# EAGLE design untitled (EAGLE 9.6.2)
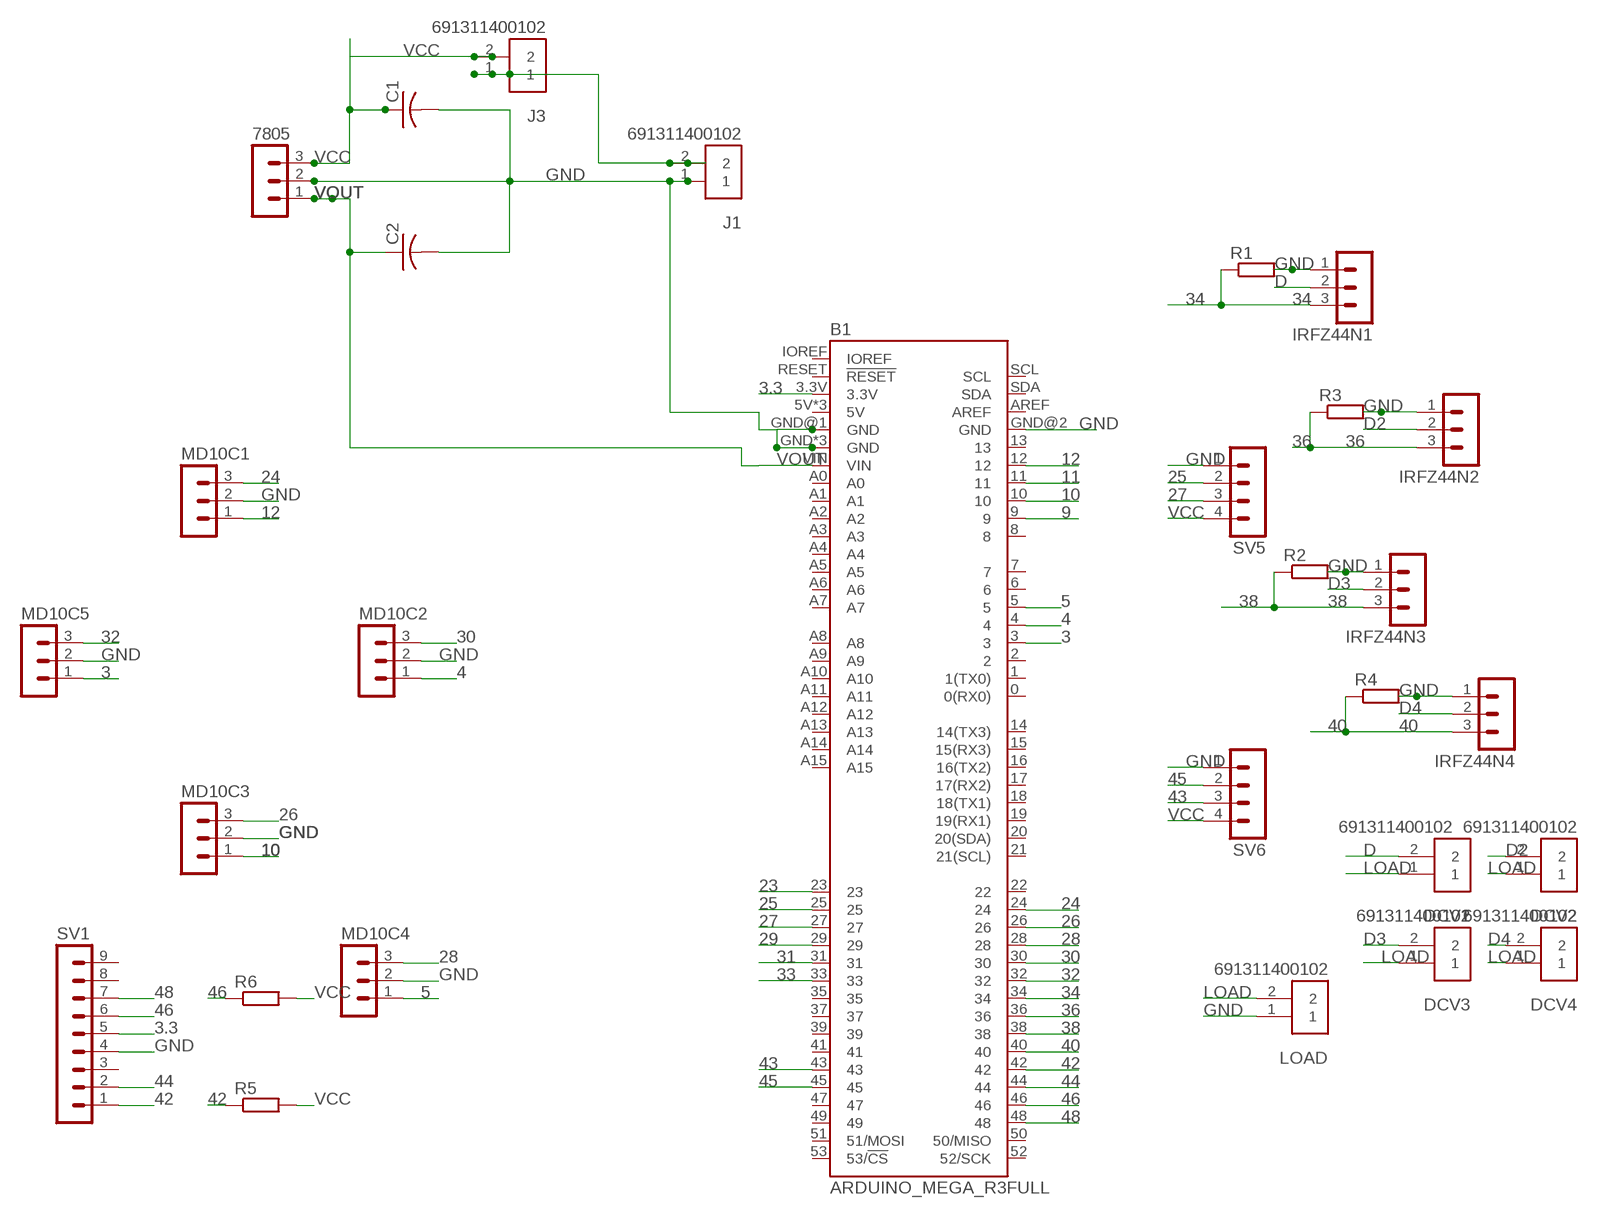
[diagram p0: schematic, sheet 1]

## Parts
7805  MA03-1  [MA03-1]
B1  ARDUINO_MEGA_R3FULL  [ARDUINO_MEGA_NO_SILK]
C1  C-US025-024X044  [C025-024X044]
C2  C-US025-024X044  [C025-024X044]
DCV1  691311400102  [TERMINALBLOCK_PLUGGABLE-2-7.62MM]
DCV2  691311400102  [TERMINALBLOCK_PLUGGABLE-2-7.62MM]
DCV3  691311400102  [TERMINALBLOCK_PLUGGABLE-2-7.62MM]
DCV4  691311400102  [TERMINALBLOCK_PLUGGABLE-2-7.62MM]
IRFZ44N1  MA03-1  [MA03-1]
IRFZ44N2  MA03-1  [MA03-1]
IRFZ44N3  MA03-1  [MA03-1]
IRFZ44N4  MA03-1  [MA03-1]
J1  691311400102  [TERMINALBLOCK_PLUGGABLE-2-7.62MM]
J3  691311400102  [TERMINALBLOCK_PLUGGABLE-2-7.62MM]
LOAD  691311400102  [TERMINALBLOCK_PLUGGABLE-2-7.62MM]
MD10C1  MA03-1  [MA03-1]
MD10C2  MA03-1  [MA03-1]
MD10C3  MA03-1  [MA03-1]
MD10C4  MA03-1  [MA03-1]
MD10C5  MA03-1  [MA03-1]
R1  R-EU_0204_5  [0204/5]
R2  R-EU_0204_5  [0204/5]
R3  R-EU_0204_5  [0204/5]
R4  R-EU_0204_5  [0204/5]
R5  R-EU_0204_5  [0204/5]
R6  R-EU_0204_5  [0204/5]
SV1  MA09-1  [MA09-1]
SV5  MA04-1  [MA04-1]
SV6  MA04-1  [MA04-1]

## Nets
3: B1.3 MD10C5.1
3.3: B1.3.3V SV1.5
4: B1.4 MD10C2.1
5: B1.5 MD10C4.1
9: B1.9
10: B1.10 MD10C3.1
11: B1.11
12: B1.12 MD10C1.1
23: B1.23
24: B1.24 MD10C1.3
25: B1.25 SV5.2
26: B1.26 MD10C3.3
27: B1.27 SV5.3
28: B1.28 MD10C4.3
29: B1.29
30: B1.30 MD10C2.3
31: B1.31
32: B1.32 MD10C5.3
33: B1.33
34: B1.34 IRFZ44N1.3 R1.1
36: B1.36 IRFZ44N2.3 R3.1
38: B1.38 IRFZ44N3.3 R2.1
40: B1.40 IRFZ44N4.3 R4.1
42: B1.42 R5.1 SV1.1
43: B1.43 SV6.3
44: B1.44 SV1.2
45: B1.45 SV6.2
46: B1.46 R6.1 SV1.6
48: B1.48 SV1.7
D: DCV1.2 IRFZ44N1.2
D2: DCV2.2 IRFZ44N2.2
D3: DCV3.2 IRFZ44N3.2
D4: DCV4.2 IRFZ44N4.2
GND: 7805.2 B1.GND B1.GND@1(GND) B1.GND@2(GND) B1.GND@3(GND) B1.GND@4(GND) C1.2 C2.2 IRFZ44N1.1 IRFZ44N2.1 IRFZ44N3.1 IRFZ44N4.1 J1.1 LOAD.1 MD10C1.2 MD10C2.2 MD10C3.2 MD10C4.2 MD10C5.2 R1.2 R2.2 R3.2 R4.2 SV1.4 SV5.1 SV6.1
LOAD: DCV1.1 DCV2.1 DCV3.1 DCV4.1 LOAD.2
VCC: 7805.3 C1.1 J3.2 R5.2 R6.2 SV5.4 SV6.4
VIN: J1.2 J3.1
VOUT: 7805.1 B1.VIN C2.1
Unconnected: B1.0(0(RX0)) B1.1(1(TX0)) B1.2 B1.5V B1.5V@1(5V) B1.5V@2(5V) B1.6 B1.7 B1.8 B1.13 B1.14(14(TX3)) B1.15(15(RX3)) B1.16(16(TX2)) B1.17(17(RX2)) B1.18(18(TX1)) B1.19(19(RX1)) B1.20(20(SDA)) B1.21(21(SCL)) B1.22 B1.35 B1.37 B1.39 B1.41 B1.47 B1.49 B1.50(50/MISO) B1.51(51/MOSI) B1.52(52/SCK) B1.53(53/!CS) B1.A0 B1.A1 B1.A2 B1.A3 B1.A4 B1.A5 B1.A6 B1.A7 B1.A8 B1.A9 B1.A10 B1.A11 B1.A12 B1.A13 B1.A14 B1.A15 B1.AREF B1.IOREF B1.RESET(!RESET) B1.SCL B1.SDA SV1.3 SV1.8 SV1.9

## Library data of the parts
7805 IRFZ44N1-IRFZ44N4 MD10C1-MD10C5 = con-lstb:MA03-1: PIN HEADER; OC_FARNELL: unknown; OC_NEWARK: unknown
B1 = SparkFun-Boards:ARDUINO_MEGA_R3: Arduino Mega R3 ATmega2560 R3 compatible footprint. SparkFun Products: Arduino Mega 2560 R3 <https://www.sparkfun.com/products/11061>
C1 C2 = resistor:C-US: CAPACITOR, American symbol
DCV1-DCV4 J1 J3 LOAD = Terminal Blocks FOR USE IN PB:691311400102: 7.62MM CLOSE VERTICAL PCB HEADER WR-TBL Manufacturer's datasheet <https://katalog.we-online.com/em/datasheet/6913114001xx.pdf>; CREATED_BY: PCBLayout.com; DIGIKEY_PART_NO: 732-2823-ND; MANUFACTURER: WURTH ELEKTRONIK; MPN: 691311400102
R1-R6 = resistor:R-EU_: RESISTOR, European symbol; SPICEPREFIX: R
SV1 = con-lstb:MA09-1: PIN HEADER; OC_FARNELL: unknown; OC_NEWARK: unknown
SV5 SV6 = con-lstb:MA04-1: PIN HEADER; OC_FARNELL: unknown; OC_NEWARK: unknown

## Board
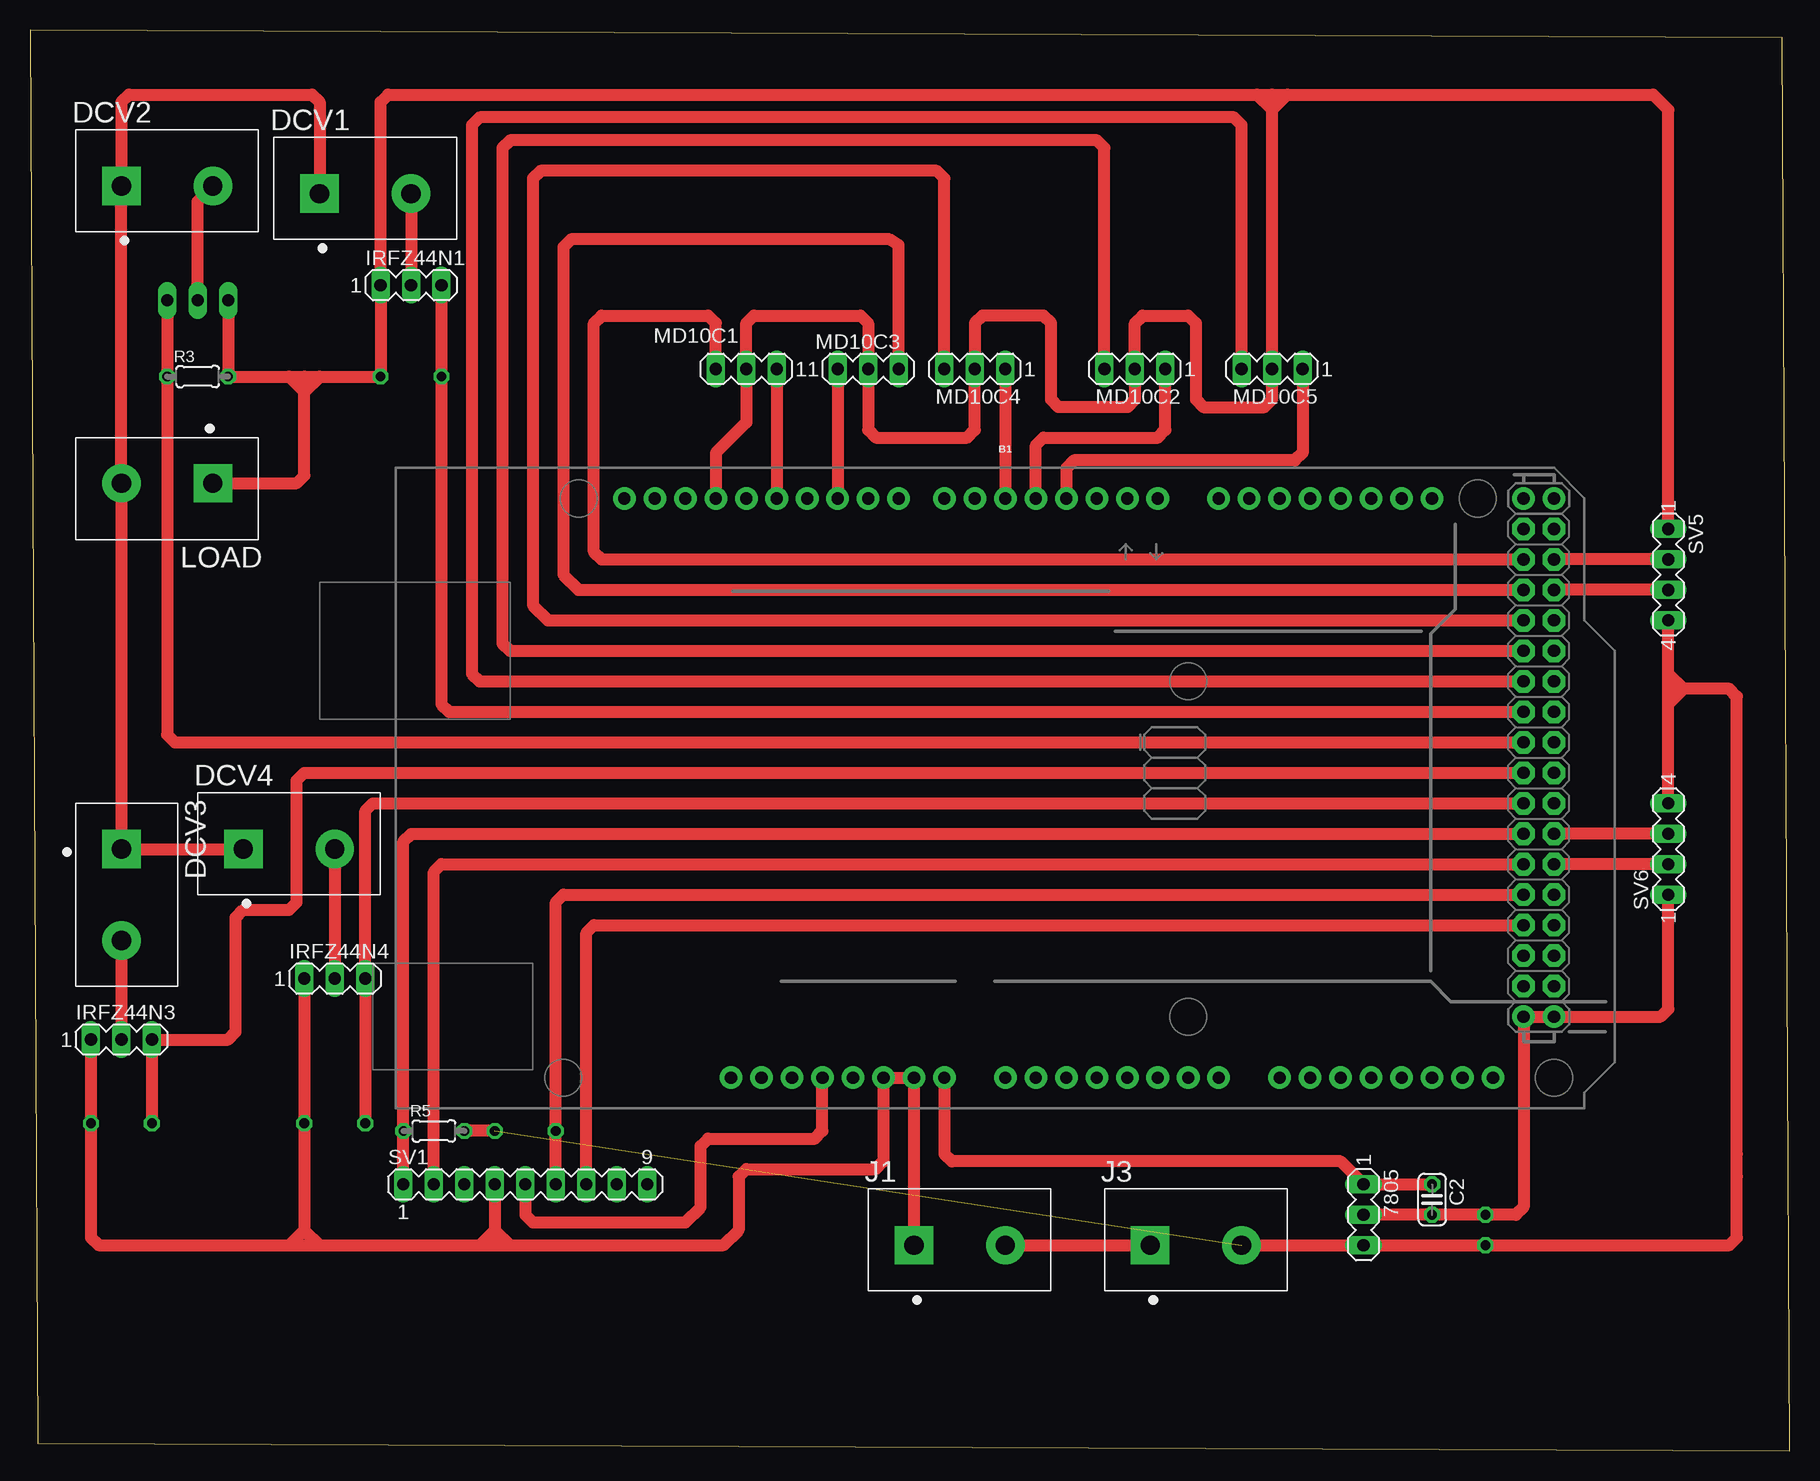
[diagram p1: board, top side]
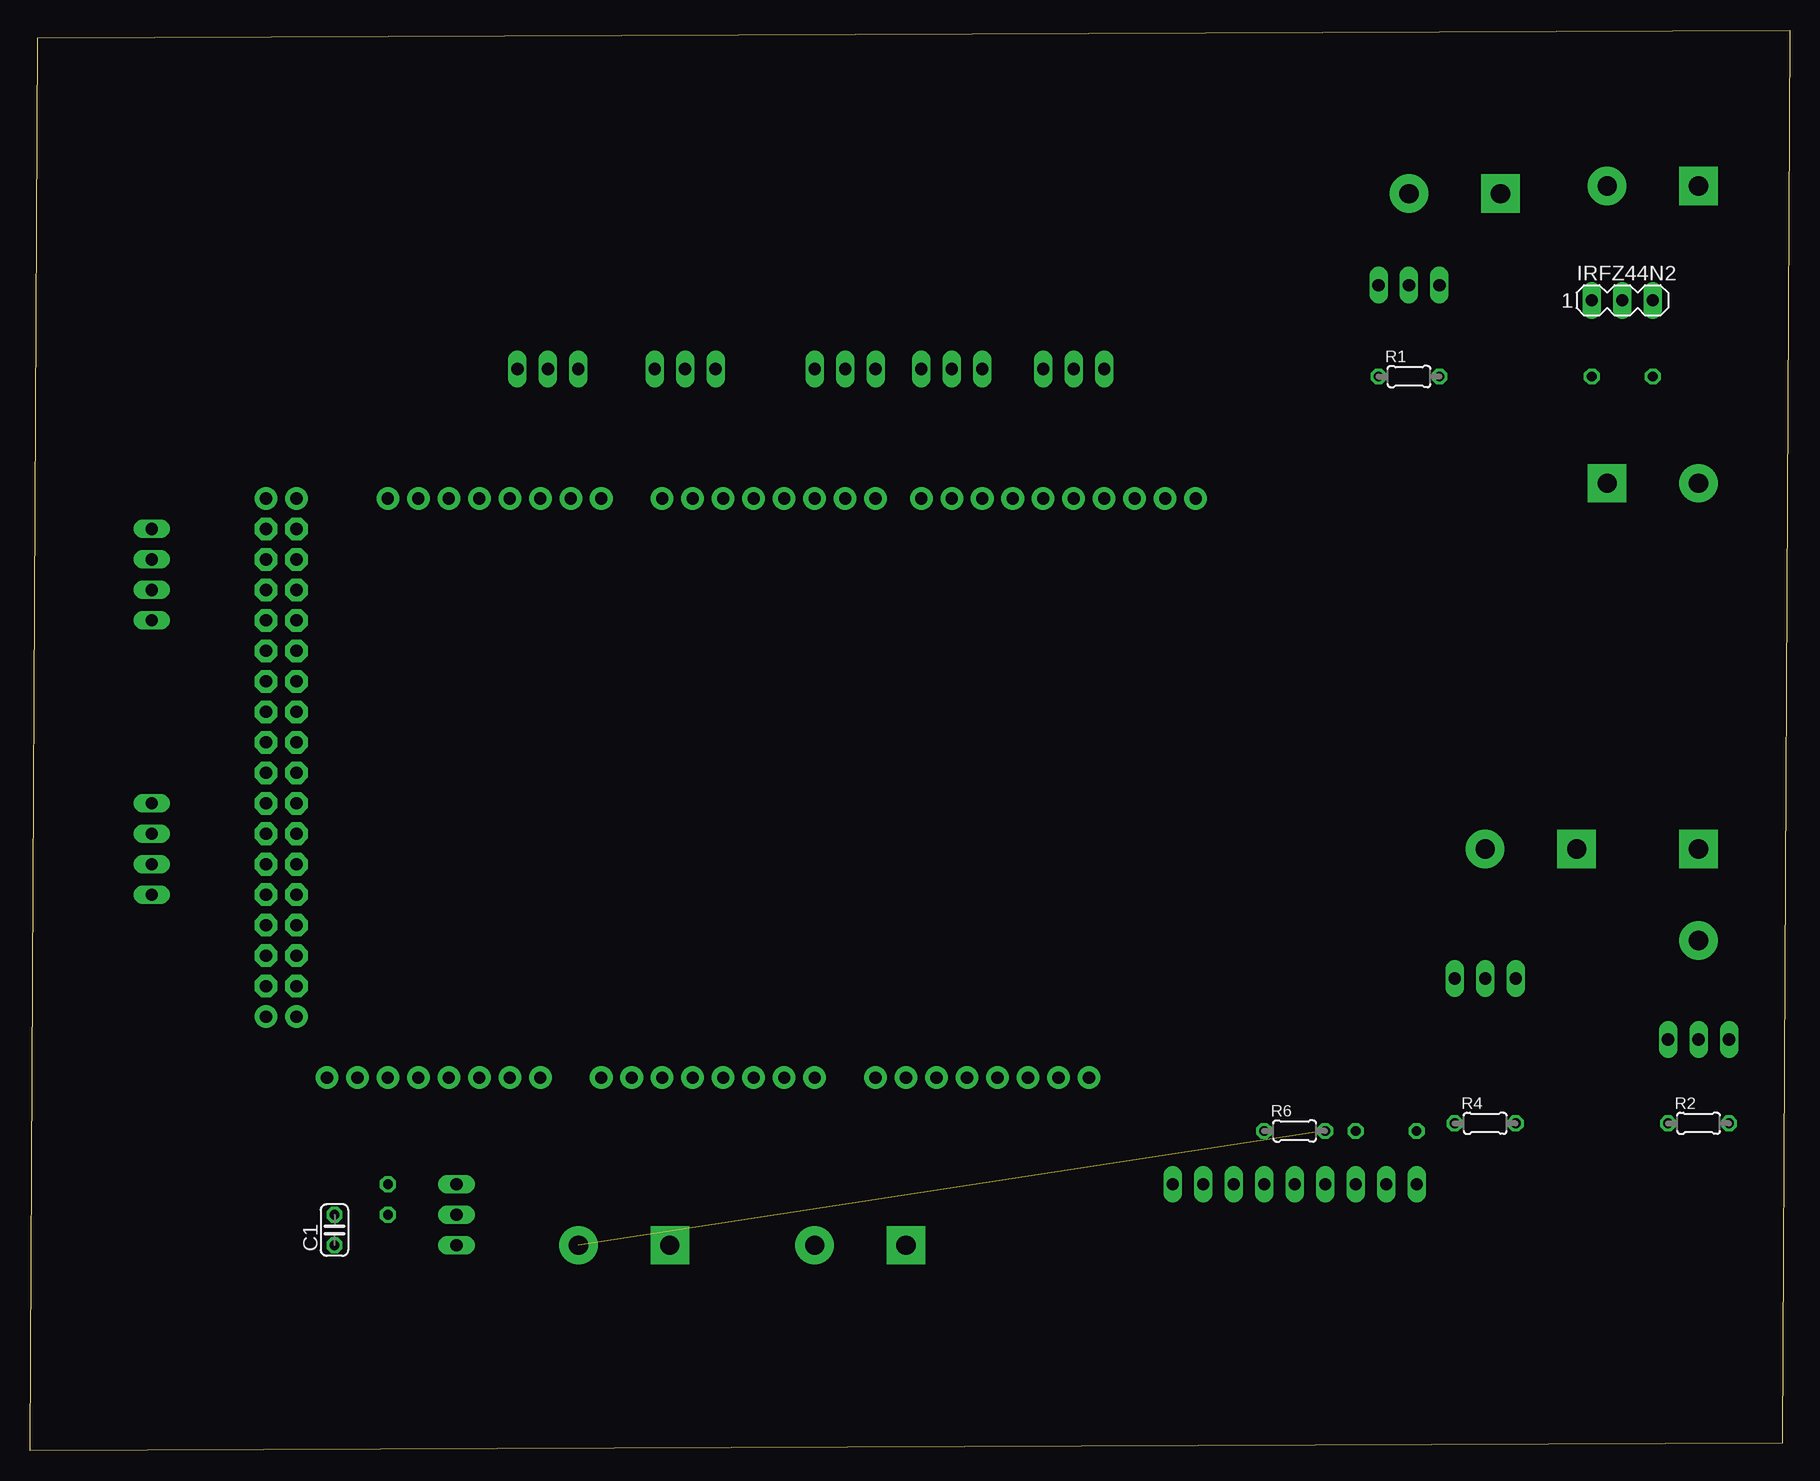
[diagram p2: board, bottom side, seen from below]

Size 146.66 x 118.41 mm. Coordinates in mm from the lower left corner, seen from the top.
Outline: 0.64,0.64 146.66,0 146.03,117.78 0,118.41 0.64,0.64
Copper layers (1*16): Top 0.035mm / dielectric 1.5mm / Bottom 0.035mm
Design rules "default": minimum track width 6mil, minimum drill 0.35mm, track to track 6mil, track to pad 6mil, pad to pad 6mil, via to via 6mil, smd to smd 6mil, copper to edge 40mil, drill to drill 6mil, minimum pad ring 10mil, minimum via ring 8mil, stop-mask expansion 4mil, vias tented up to drill 0mil, thermal gap 10mil

### Footprints (pad centres in the part's own frame; a part is rotated, then mirrored left to right if it is on the bottom)
MA03-1 = drill 1.016 long: 1 -2.54,0; 2 0,0; 3 2.54,0
ARDUINO_MEGA_NO_SILK = drill 1.016 pad 1.88: 0 13.97,24.13; 1 11.43,24.13; 2 8.89,24.13; 3 6.35,24.13; 3.3V -13.97,-24.13; 4 3.81,24.13; 5 1.27,24.13; 5V -11.43,-24.13; 5V@1 44.45,24.13; 5V@2 46.99,24.13; 6 -1.27,24.13; 7 -3.81,24.13; 8 -7.62,24.13; 9 -10.16,24.13; 10 -12.7,24.13; 11 -15.24,24.13; 12 -17.78,24.13; 13 -20.32,24.13; 14 19.05,24.13; 15 21.59,24.13; 16 24.13,24.13; 17 26.67,24.13; 18 29.21,24.13; 19 31.75,24.13; 20 34.29,24.13; 21 36.83,24.13; A0 1.27,-24.13; A1 3.81,-24.13; A2 6.35,-24.13; A3 8.89,-24.13; A4 11.43,-24.13; A5 13.97,-24.13; A6 16.51,-24.13; A7 19.05,-24.13; A8 24.13,-24.13; A9 26.67,-24.13; A10 29.21,-24.13; A11 31.75,-24.13; A12 34.29,-24.13; A13 36.83,-24.13; A14 39.37,-24.13; A15 41.91,-24.13; AREF -25.4,24.13; GND -8.89,-24.13; GND@1 -6.35,-24.13; GND@2 44.45,-19.05; GND@3 46.99,-19.05; GND@4 -22.86,24.13; IOREF -19.05,-24.13; NC -21.59,-24.13; RESET -16.51,-24.13; SCL -30.48,24.13; SDA -27.94,24.13; VIN -3.81,-24.13 | drill 1.016 pad 1.88 octagon: 22 44.45,21.59; 23 46.99,21.59; 24 44.45,19.05; 25 46.99,19.05; 26 44.45,16.51; 27 46.99,16.51; 28 44.45,13.97; 29 46.99,13.97; 30 44.45,11.43; 31 46.99,11.43; 32 44.45,8.89; 33 46.99,8.89; 34 44.45,6.35; 35 46.99,6.35; 36 44.45,3.81; 37 46.99,3.81; 38 44.45,1.27; 39 46.99,1.27; 40 44.45,-1.27; 41 46.99,-1.27; 42 44.45,-3.81; 43 46.99,-3.81; 44 44.45,-6.35; 45 46.99,-6.35; 46 44.45,-8.89; 47 46.99,-8.89; 48 44.45,-11.43; 49 46.99,-11.43; 50 44.45,-13.97; 51 46.99,-13.97; 52 44.45,-16.51; 53 46.99,-16.51
C025-024X044 = drill 0.813 octagon: 1 -1.27,0; 2 1.27,0
TERMINALBLOCK_PLUGGABLE-2-7.62MM = drill 1.6 pad 3.2 square: 1 -3.81,0 | drill 1.6 pad 3.2: 2 3.81,0
0204/5 = drill 0.813 octagon: 1 -2.54,0; 2 2.54,0
MA09-1 = drill 1.016 long: 1 -10.16,0; 2 -7.62,0; 3 -5.08,0; 4 -2.54,0; 5 0,0; 6 2.54,0; 7 5.08,0; 8 7.62,0; 9 10.16,0
MA04-1 = drill 1.016 long: 1 -3.81,0; 2 -1.27,0; 3 1.27,0; 4 3.81,0

### Placement (x,y rotation side)
7805  111.12,19.69 270 top
B1  80.01,55.25 0 top
C1  121.29,18.42 90 bottom
C2  116.84,20.96 270 top
DCV1  27.94,104.78 0 top
DCV2  11.43,105.41 0 top
DCV3  7.62,46.36 270 top
DCV4  21.59,50.17 0 top
IRFZ44N1  31.75,97.16 0 top
IRFZ44N2  13.97,95.88 0 bottom
IRFZ44N3  7.62,34.29 0 top
IRFZ44N4  25.4,39.37 0 top
J1  77.47,17.15 0 top
J3  97.16,17.15 0 top
LOAD  11.43,80.65 180 top
MD10C1  59.69,90.17 180 top
MD10C2  92.08,90.17 180 top
MD10C3  69.85,90.17 0 top
MD10C4  78.74,90.17 180 top
MD10C5  103.51,90.17 180 top
R1  31.75,89.53 0 bottom
R2  7.62,27.3 0 bottom
R3  13.97,89.53 0 top
R4  25.4,27.3 0 bottom
R5  33.65,26.67 0 top
R6  41.27,26.67 0 bottom
SV1  41.27,22.23 0 top
SV5  136.52,73.03 270 top
SV6  136.52,50.17 90 top

### Tracks (layer width: path | path; a pad name or v marks a point on that pad's centre or on a via)
3
  Top 1.016: MD10C5.1 106.05,83.19 105.41,82.55 87,82.55 86.36,81.91 B1.3
3.3
  Top 1.016: SV1.5 41.27,19.69 41.91,19.05 54.61,19.05 55.88,20.32 55.88,25.4 56.51,26.04 65.41,26.04 66.04,26.67 B1.3.3V
4
  Top 1.016: B1.4 83.82,83.82 84.45,84.45 93.98,84.45 94.62,85.09 MD10C2.1
5
  Top 1.016: MD10C4.1 B1.5
10
  Top 1.016: MD10C3.1 B1.10
12
  Top 1.016: MD10C1.1 B1.12
24
  Top 1.016: MD10C1.3 57.15,93.98 56.51,94.62 47.62,94.62 46.99,93.98 46.99,74.93 47.62,74.3 B1.24
25
  Top 1.016: SV5.2 B1.25
26
  Top 1.016: B1.26 45.72,71.75 44.45,73.03 44.45,100.33 45.08,100.97 71.63,100.97 72.39,100.49 MD10C3.3
27
  Top 1.016: SV5.3 B1.27
28
  Top 1.016: MD10C4.3 76.2,106.04 75.56,106.68 42.54,106.68 41.91,106.04 41.91,70.48 43.18,69.22 B1.28
30
  Top 1.016: MD10C2.3 89.54,108.59 88.9,109.22 40,109.22 39.37,108.59 39.37,67.31 40,66.68 B1.30
32
  Top 1.016: MD10C5.3 100.97,110.49 100.33,111.12 37.46,111.12 36.83,110.49 36.83,64.77 37.46,64.13 B1.32
34
  Top 1.016: IRFZ44N1.3 R1.1 34.29,62.23 34.92,61.59 B1.34
36
  Top 0.152: 124.46,58.95 B1.36
  Top 1.016: IRFZ44N2.3 R3.1 11.43,59.69 12.07,59.05 B1.36
38
  Top 1.016: R2.1 IRFZ44N3.3 16.51,34.29 17.14,34.92 17.14,44.45 17.78,45.09 21.59,45.09 22.23,45.72 22.23,55.88 22.86,56.52 B1.38
40
  Top 1.016: R4.1 IRFZ44N4.3 27.94,53.34 28.57,53.98 B1.40
42
  Top 1.016: SV1.1 R5.1 31.11,50.8 31.75,51.44 B1.42
43
  Top 1.016: SV6.3 B1.43
44
  Top 1.016: SV1.2 33.65,48.26 34.29,48.9 B1.44
45
  Top 1.016: SV6.2 B1.45
46
  Top 1.016: SV1.6 R6.1 43.81,45.72 44.45,46.36 B1.46
48
  Top 1.016: SV1.7 46.35,43.18 46.99,43.81 B1.48
D
  Top 1.016: DCV1.2 IRFZ44N1.2
D2
  Top 1.016: IRFZ44N2.2 13.97,104.14 DCV2.2
  Bottom 0.152: 14.07,95.94 IRFZ44N2.2
D3
  Top 1.016: DCV3.2 IRFZ44N3.2
D4
  Top 1.016: DCV4.2 IRFZ44N4.2
GND
  Top 1.016: B1.GND@4 57.15,83.19 59.69,85.72 MD10C1.2 59.69,93.98 60.32,94.62 69.22,94.62 69.85,93.98 MD10C3.2 69.85,85.09 70.48,84.45 78.11,84.45 78.74,85.09 MD10C4.2 78.74,93.98 79.38,94.62 84.45,94.62 85.09,93.98 85.09,87.63 85.73,87 91.44,87 92.08,87.63 MD10C2.2 92.08,93.98 92.71,94.62 96.52,94.62 97.16,93.98 97.16,87.63 97.79,87 102.87,87 103.51,87.63 MD10C5.2 103.51,111.76 | IRFZ44N4.1 R4.2 22.86,18.42 | 21.59,17.15 5.71,17.15 5.08,17.78 R2.2 IRFZ44N3.1 | 39.47,17.15 40,17.15 | 40,17.15 57.78,17.15 59.05,18.42 59.05,22.86 59.69,23.5 70.48,23.5 71.12,24.13 B1.GND B1.GND@1 J1.1 | 102.23,113.03 29.84,113.03 29.21,112.4 IRFZ44N1.1 R1.2 24.13,89.53 | 102.23,113.03 103.51,113.03 | 103.51,113.03 104.78,113.03 | 104.78,113.03 135.25,113.03 136.52,111.76 SV5.1 | IRFZ44N2.1 R3.2 21.59,89.53 | 21.59,89.53 22.86,89.53 | 22.86,89.53 24.13,89.53 | SV6.1 136.52,36.83 135.89,36.2 B1.GND@3 B1.GND@2 124.46,20.32 123.83,19.69 C1.2 C2.2 7805.2 | LOAD.1 22.23,80.65 22.86,81.28 22.86,88.27 | 22.86,88.27 22.86,89.53 | 22.86,88.27 24.13,89.53 | 22.86,88.27 21.59,89.53 | 103.51,111.76 103.51,113.03 | 21.59,17.15 22.86,18.42 | SV1.4 38.73,18.42 | 39.47,17.15 38.73,17.88 38.73,18.42 | 38.73,18.42 40,17.15 | 22.86,18.42 24.13,17.15 | 24.13,17.15 37.46,17.15 | 37.46,17.15 39.47,17.15 | 38.73,18.42 37.46,17.15 | 21.59,17.15 24.13,17.15 | 103.51,111.76 104.78,113.03 | 103.51,111.76 102.23,113.03
LOAD
  Top 1.016: DCV4.1 DCV3.1 LOAD.2 DCV2.1 7.62,112.4 8.26,113.03 23.5,113.03 24.13,112.4 DCV1.1
VCC  (1 unrouted)
  Top 1.016: SV6.4 136.52,62.23 | 136.52,62.23 136.52,63.5 | 136.52,63.5 136.52,64.77 | 136.52,64.77 SV5.4 | R6.2 R5.2 | 137.79,63.5 141.6,63.5 142.24,62.87 142.24,24.77 142.24,22.86 142.24,17.78 141.6,17.15 C1.1 7805.3 J3.2 | 137.79,63.5 136.52,63.5 | 136.52,64.77 137.79,63.5 | 137.79,63.5 136.52,62.23
VIN
  Top 1.016: J1.2 J3.1
VOUT
  Top 1.016: C2.1 7805.1 109.22,24.13 76.84,24.13 76.2,24.77 B1.VIN